# Altium schematic sheet RS485 IO.SchDoc: RS-485
size A4; Date: 31 08 2013; Author: Rachid AKKOUCHE; CompanyName: RASoftware; DrawnBy: Rachid AKKOUCHE; Engineer: Rachid AKKOUCHE; Organization: RASoftware; Address1: 52 J03, rue de la crèche; Address2: 77100 MEAUX; Address3: FRANCE; DocumentNumber: BRA2013090103C4; Revision: C; SheetNumber: 4; SheetTotal: 4; Telephone: +33651604047; Email: rachid.akkouche@wanadoo.fr; Dessinepar: -; Verifiepar: -; Property: RASoftware; Time: 13:22
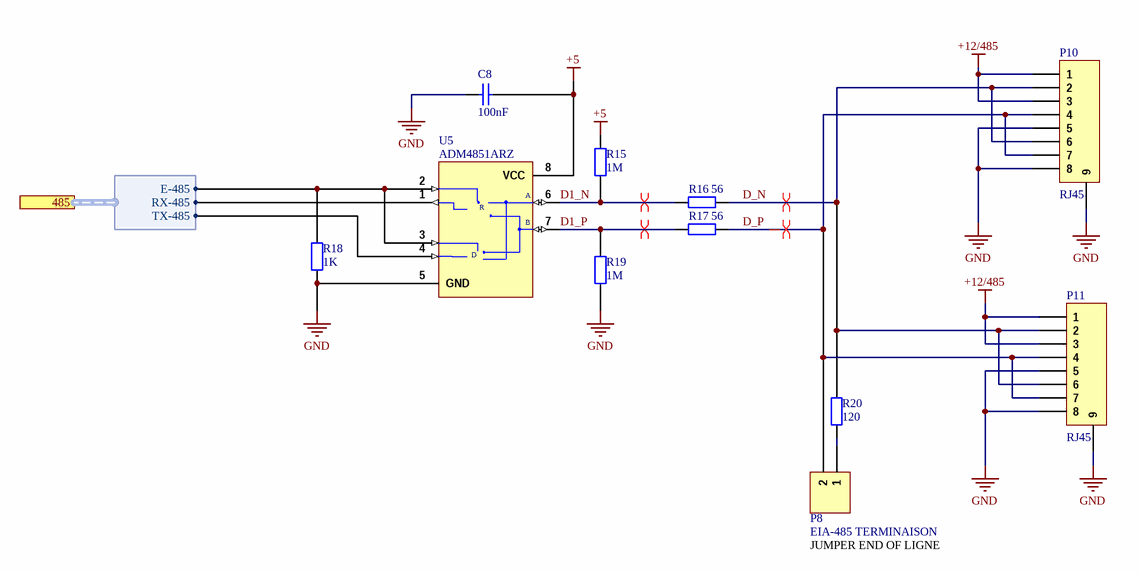
[diagram p0: RS485 IO.SchDoc]

## Parts
C8  100nF  [C0805]
P8  EIA-485 TERMINAISON  [M20_1X2]
P10  RJ45  [RJ45_8-5406721-1]
P11  RJ45  [RJ45_8-5406721-1]
R15  1M  [R0805]
R16  56  [R0805]
R17  56  [R0805]
R18  1K  [R0805]
R19  1M  [R0805]
R20  120  [R0805]
U5  ADM4851ARZ  [SOIC8]

## Ports
485 (harness EIA-485)

## Harnesses
EIA-485: TX-485, RX-485, E-485

## Nets
+5: C8.1 R15.2 U5.8(VCC)
+12/485: P10.1 P10.3 P11.1 P11.3
GND: C8.2 P10.5 P10.8 P10.9 P11.5 P11.8 P11.9 R18.1 R19.1 U5.5(GND)
D1_N: R15.1 R16.1 U5.6(A)
D1_P: R17.1 R19.2 U5.7(B)
D_N: P10.2 P10.6 P11.2 P11.6 R16.2 R20.2
D_P: P8.2 P10.4 P10.7 P11.4 P11.7 R17.2
NetP8_1: P8.1 R20.1
NetR18_2: R18.2 U5.2(~{RE}) U5.3(DE) ; port 485.E-485
NetU5_1: U5.1(RO) ; port 485.RX-485
NetU5_4: U5.4(DI) ; port 485.TX-485

## Layout directives
differential pair: D1_N, D1_P, D_N, D_P

## Notes on the sheet
- JUMPER END OF LIGNE
- Ce document est la propriété de
- Project:
- Il ne peut être divulgué sans l'accord écrit de l'un de ses représentants dûment mandaté
- Title:
- Number:
- Date:
- Time:
- Size:
- A4
- Revision:
- Sheet
- of
- 52 J03 rue de la crèche
- Draw by:
- 77100 Meaux
- (in symbol MAX485ESA) R; D

## Library data of the parts
C8 = Cap 0805 100nF: Capacitor; Manufacturer: MULTICOMP; Manufacturer Part Number: MCCA000296; Supplier 1: Farnell; Supplier Part Number 1: 1759167; Pricing 1: 100=0,01, 500=0,008, 1000=0,006, 4000=0,005 (EUR); ComponentLink1URL: http://www.farnell.com/datasheets/1520827.pdf; ComponentLink1Description: http://www.farnell.com/datasheets/1520827.pdf
P8 = Header 2: Header, 2-Pin; Manufacturer: HARWIN; Manufacturer Part Number: M20-8770242; Product Range: HARWIN - M20-87 Series; Terminaison du contact: PCB; Genre: Connecteur mâle; Nombre de contacts: 2; Nombre de rangées: 1; Pas: 2.54; Plaquage du contact: Or; Matériau du contact: Laiton; SVHC: No SVHC (20-Jun-2013); LatestRevisionDate: 17-Jul-2002; LatestRevisionNote: Re-released for DXP Platform.; Publisher: Altium Limited; Supplier 1: Farnell; Supplier Part Number 1: 1895211; RoHS: YES; Pricing 1: 10=0,137, 20=0,136, 50=0,135, 100=0,133, 250=0,128, 500=0,12 (EUR); ComponentLink1URL: http://www.farnell.com/cad/1330190.pdf; ComponentLink1Description: http://www.farnell.com/cad/1330190.pdf
P10 P11 = Header 8: Header, 8-Pin; Manufacturer: TE CONNECTIVITY / AMP; Manufacturer Part Number: 5406721-1; Supplier 1: Farnell; Supplier Part Number 1: 2452589; RoHS: YES; Stock 1: 1018; Pricing 1: 10=1.33, 50=1.2, 100=1.1, 250=1.02, 500=0.946, 1000=0.927 (EUR); ComponentLink1URL: http://www.farnell.com/cad/1637338.pdf; ComponentLink1Description: http://www.farnell.com/cad/1637338.pdf
R15 R19 = Resistor 0805 1M: Resistor
R16 R17 = Resistor 0805 56: Resistor; Manufacturer: MULTICOMP; Manufacturer Part Number: MC01W0805156R; Product Range: MULTICOMP - MC Series; Puissance: 100; Tolérance de résistance: ± 1%; Type de boîtier de résistance: 0805; Type de résistance: Couche épaisse; Coefficient de température: ± 200; Tension: 150; Type de packaging: Full Reel; SVHC: No SVHC (20-Jun-2013); Resistor Mounting: CMS; Supplier 1: Farnell; RoHS: YES; Pricing 1: 5000=0,001 (EUR); Résistance: 56; MSL: (Non Applicable); ComponentLink1URL: http://www.farnell.com/datasheets/1729047.pdf; ComponentLink1Description: http://www.farnell.com/datasheets/1729047.pdf; Supplier Part Number 1: 2129016
R18 = Resistor 0805 1K: Resistor; Manufacturer: MULTICOMP; Manufacturer Part Number: MC0.1W08051%1KFR; Product Range: MULTICOMP - MC Series; Résistance: 1; Puissance: 100; Tolérance de résistance: ± 1%; Type de boîtier de résistance: 0805; Type de résistance: Couche épaisse; Coefficient de température: ± 100; Tension: 150; Type de packaging: Full Reel; Resistor Mounting: CMS; Supplier 1: Farnell; RoHS: YES; Pricing 1: 5000=0,001 (EUR); MSL: MSL 1 - Illimité; ComponentLink1URL: http://www.farnell.com/datasheets/1716700.pdf; ComponentLink1Description: http://www.farnell.com/datasheets/1716700.pdf; Supplier Part Number 1: 2129113
R20 = Resistor 0805 120: Resistor; Manufacturer: MULTICOMP; Manufacturer Part Number: MC01W080516K49; Product Range: MULTICOMP - MC Series; Résistance: 6.49; Puissance: 100; Tolérance de résistance: ± 1%; Type de boîtier de résistance: 0805; Type de résistance: Couche épaisse; Coefficient de température: ± 100; Tension: 150; Type de packaging: Full Reel; SVHC: No SVHC (20-Jun-2013); Resistor Mounting: CMS; Supplier 1: Farnell; RoHS: YES; Pricing 1: 5000=0,001 (EUR); MSL: (Non Applicable); ComponentLink1URL: http://www.farnell.com/datasheets/1729047.pdf; ComponentLink1Description: http://www.farnell.com/datasheets/1729047.pdf; Supplier Part Number 1: 2129181
U5 = MAX485ESA: Low-Power, Slew-Rate-Limited RS-485/RS-422 Transceiver; Manufacturer: ANALOG DEVICES; Type de driver: Émetteur-récepteur de ligne différentiel; Type d'interface CI: RS422, RS485; Nombre de drivers: 1; Tension, alimentation min.: 4.75; Tension, alimentation max..: 5.25; Type de boîtier CI Driver: NSOIC; Nombre de broches: 8; Température d'utilisation min: -40; Température de fonctionnement max..: 85; SVHC: No SVHC (20-Jun-2013); Supplier 1: Farnell; Supplier Part Number 1: 2313594; Manufacturer Part Number: ADM4851ARZ; RoHS: YES; Pricing 1: 1=1,39, 10=1,13, 100=1,01, 250=0,9, 500=0,79 (EUR); MSL: MSL 1 - Illimité; ComponentLink1URL: http://www.analog.com/static/imported-files/data_sheets/ADM4850_4851_4852_4853_4854_4855_4856_4857.pdf; ComponentLink1Description: http://www.analog.com/static/imported-files/data_sheets/ADM4850_4851_4852_4853_4854_4855_4856_4857.pdf; ComponentLink2URL: http://www.farnell.com/cad/1713403.zip; ComponentLink2Description: http://www.farnell.com/cad/1713403.zip